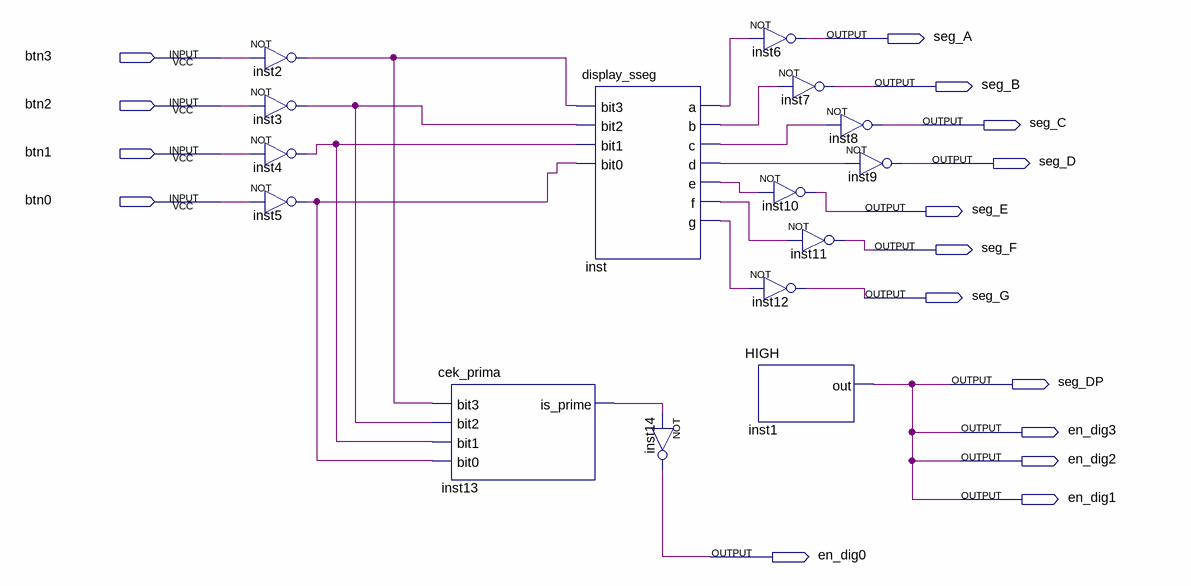
[diagram p0: schematic sheet]
// Quartus schematic tes_prima_sseg.bdf as structural Verilog: 15 symbols, 16 pins
module tes_prima_sseg (
  input  btn3,
  input  btn2,
  input  btn1,
  input  btn0,
  output seg_A,
  output seg_B,
  output seg_C,
  output seg_D,
  output seg_E,
  output seg_F,
  output seg_G,
  output seg_DP,
  output en_dig3,
  output en_dig2,
  output en_dig1,
  output en_dig0
);

  wire inst2_out, inst3_out, inst4_out, inst5_out, inst13_is_prime, inst_a, inst_b, inst_c, inst_d, inst_e,
       inst_f, inst_g;

  not inst2 (inst2_out, btn3);
  not inst3 (inst3_out, btn2);
  not inst4 (inst4_out, btn1);
  not inst5 (inst5_out, btn0);
  cek_prima inst13 (.bit3(inst2_out), .bit2(inst3_out), .bit1(inst4_out), .bit0(inst5_out), .is_prime(inst13_is_prime));
  display_sseg inst (
    .bit3(inst2_out), .bit2(inst3_out), .bit1(inst4_out), .bit0(inst5_out), .a(inst_a), .b(inst_b),
    .c(inst_c), .d(inst_d), .e(inst_e), .f(inst_f), .g(inst_g));
  not inst14 (en_dig0, inst13_is_prime);
  not inst6 (seg_A, inst_a);
  not inst7 (seg_B, inst_b);
  not inst10 (seg_E, inst_e);
  not inst11 (seg_F, inst_f);
  not inst12 (seg_G, inst_g);
  HIGH inst1 (.out(en_dig1));
  not inst8 (seg_C, inst_c);
  not inst9 (seg_D, inst_d);

  assign en_dig2 = en_dig1;
  assign en_dig3 = en_dig1;
  assign seg_DP = en_dig1;
endmodule
